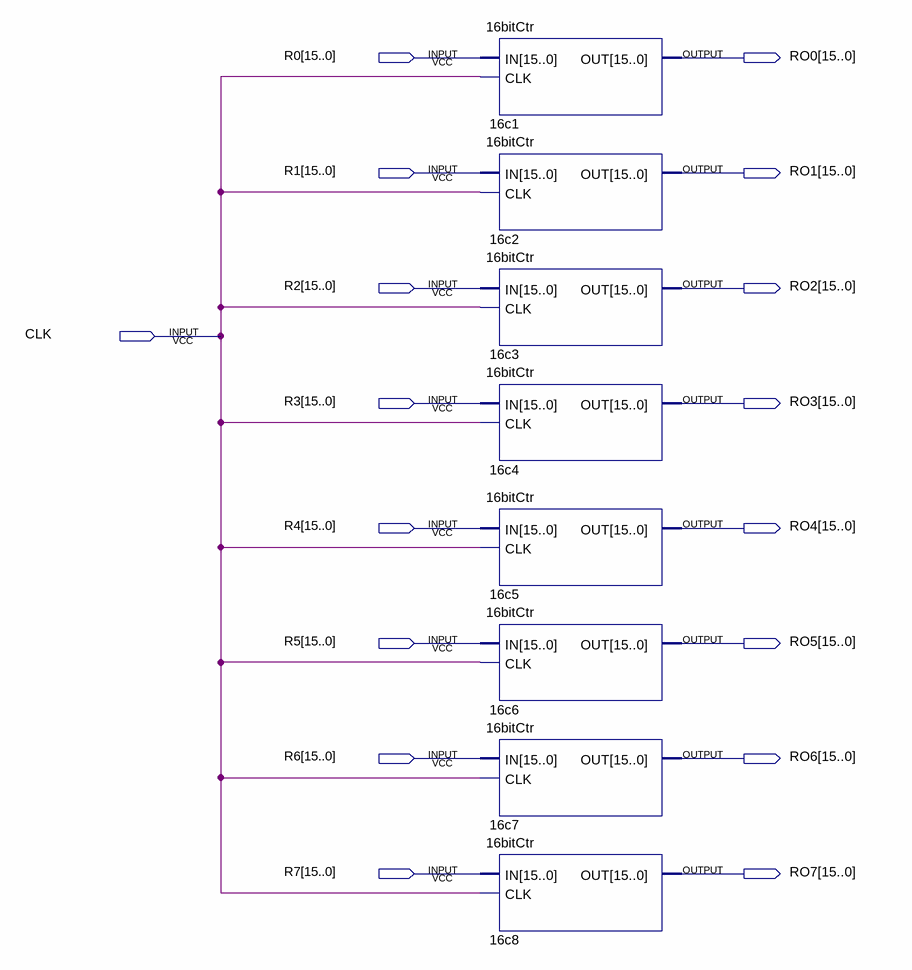
[diagram p0: schematic sheet]
// Quartus schematic 8regesters.bdf as structural Verilog: 8 symbols, 17 pins
module \8regesters  (
  input  [15:0] R0,
  input  [15:0] R1,
  input  [15:0] R2,
  input  CLK,
  input  [15:0] R3,
  input  [15:0] R4,
  input  [15:0] R5,
  input  [15:0] R6,
  input  [15:0] R7,
  output [15:0] RO0,
  output [15:0] RO1,
  output [15:0] RO2,
  output [15:0] RO3,
  output [15:0] RO4,
  output [15:0] RO5,
  output [15:0] RO6,
  output [15:0] RO7
);

  \16bitCtr  u_16c1 (.IN(R0), .CLK(CLK), .OUT(RO0));
  \16bitCtr  u_16c2 (.IN(R1), .CLK(CLK), .OUT(RO1));
  \16bitCtr  u_16c3 (.IN(R2), .CLK(CLK), .OUT(RO2));
  \16bitCtr  u_16c4 (.IN(R3), .CLK(CLK), .OUT(RO3));
  \16bitCtr  u_16c5 (.IN(R4), .CLK(CLK), .OUT(RO4));
  \16bitCtr  u_16c6 (.IN(R5), .CLK(CLK), .OUT(RO5));
  \16bitCtr  u_16c7 (.IN(R6), .CLK(CLK), .OUT(RO6));
  \16bitCtr  u_16c8 (.IN(R7), .CLK(CLK), .OUT(RO7));
endmodule
